# Altium schematic sheet Steppers.SchDoc: Title
size A4; Date: *******; ApprovedBy: *******; CheckedBy: Yasiru Banayake; Author: *******; CompanyName: *******; DrawnBy: Name; Engineer: *******; Organization: *******; Address1: *******; Address2: *******; Address3: *******; Address4: *******; DocumentNumber: Doc Num; Revision: *******; SheetNumber: 10; SheetTotal: 11; Subtitle: Stepper Motor Driver JST; Project: Resturant Robot; VersionRevision: III; TotalSheet: 11; CurrentTime: *******; CurrentDate: *******; Time: *******; DocumentFullPathAndName: *******; DocumentName: *******; ModifiedDate: *******; ImagePath: *******; ProjectName: *******; Application_BuildNumber: *******
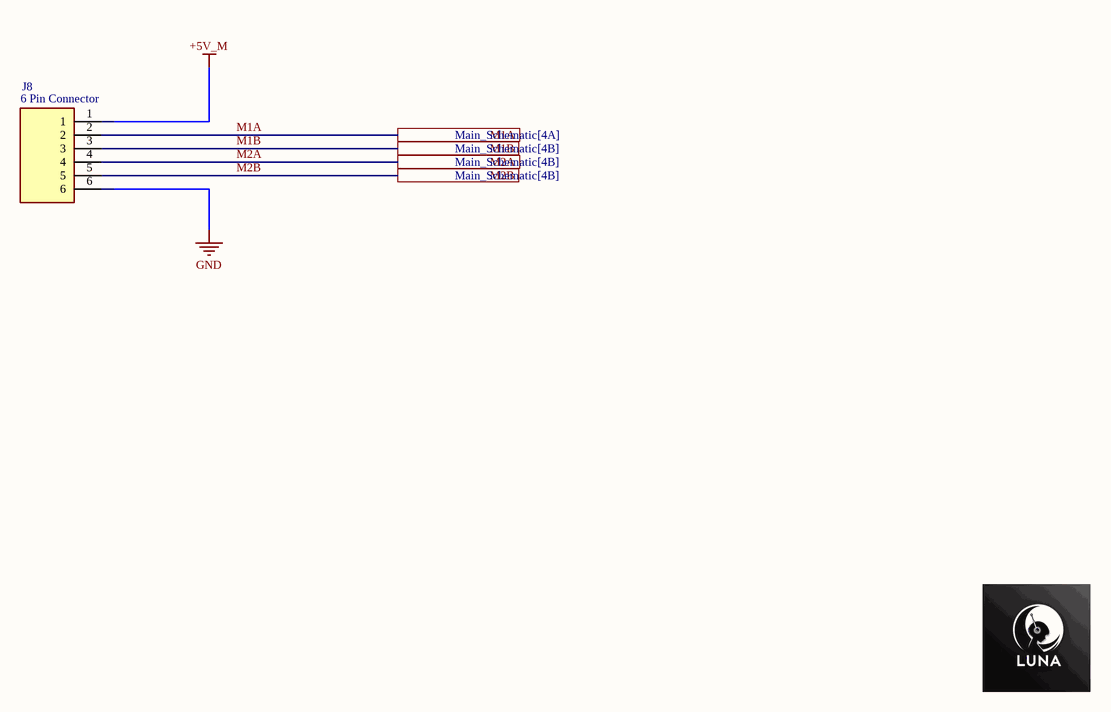
[diagram p0: Steppers.SchDoc]

## Parts
J8  6 Pin Connector  [SHDR6W64P0X250_1X6_1740X575X700P]

## Ports
M1A (see Main_Schematic[4A]), M1B (see Main_Schematic[4B]), M2A (see Main_Schematic[4B]), M2B (see Main_Schematic[4B])

## Nets
+5V_M: J8.1
GND: J8.6
M1A: J8.2 ; port M1A
M1B: J8.3 ; port M1B
M2A: J8.4 ; port M2A
M2B: J8.5 ; port M2B

## Notes on the sheet
- Title:
- Drawn By:
- Page Contents:
- Checked By:
- Subtitle:
- University Of Moratuwa
- Moratuwa
- Size:
- Date:
- File:
- Email:
- A4
- lasithnawanjaan123@gmail.com
- Lasith Haputhanthri
- Number:
- Time:
- Revision:
- Sheet
- of
- Katubedda
- 10500
- Sri Lanka

## Library data of the parts
J8 = B6B-XH-A_LF__SN_: B6B-XH-A_LF__SN_ Connector; Manufacturer_Name: JST (JAPAN SOLDERLESS TERMINALS); Manufacturer_Part_Number: B6B-XH-A(LF)(SN); Datasheet Link: https://datasheet.lcsc.com/szlcsc/JST-Sales-America-B6B-XH-A-LF-SN_C144397.pdf; Height: 7mm; Arrow Part Number: B6B-XH-A(LF)(SN); Arrow Price/Stock: https://www.arrow.com/en/products/b6b-xh-a-lf-sn/jst-manufacturing?region=europe